# EAGLE schematic Prototype_1 (EAGLE 7.2.0)
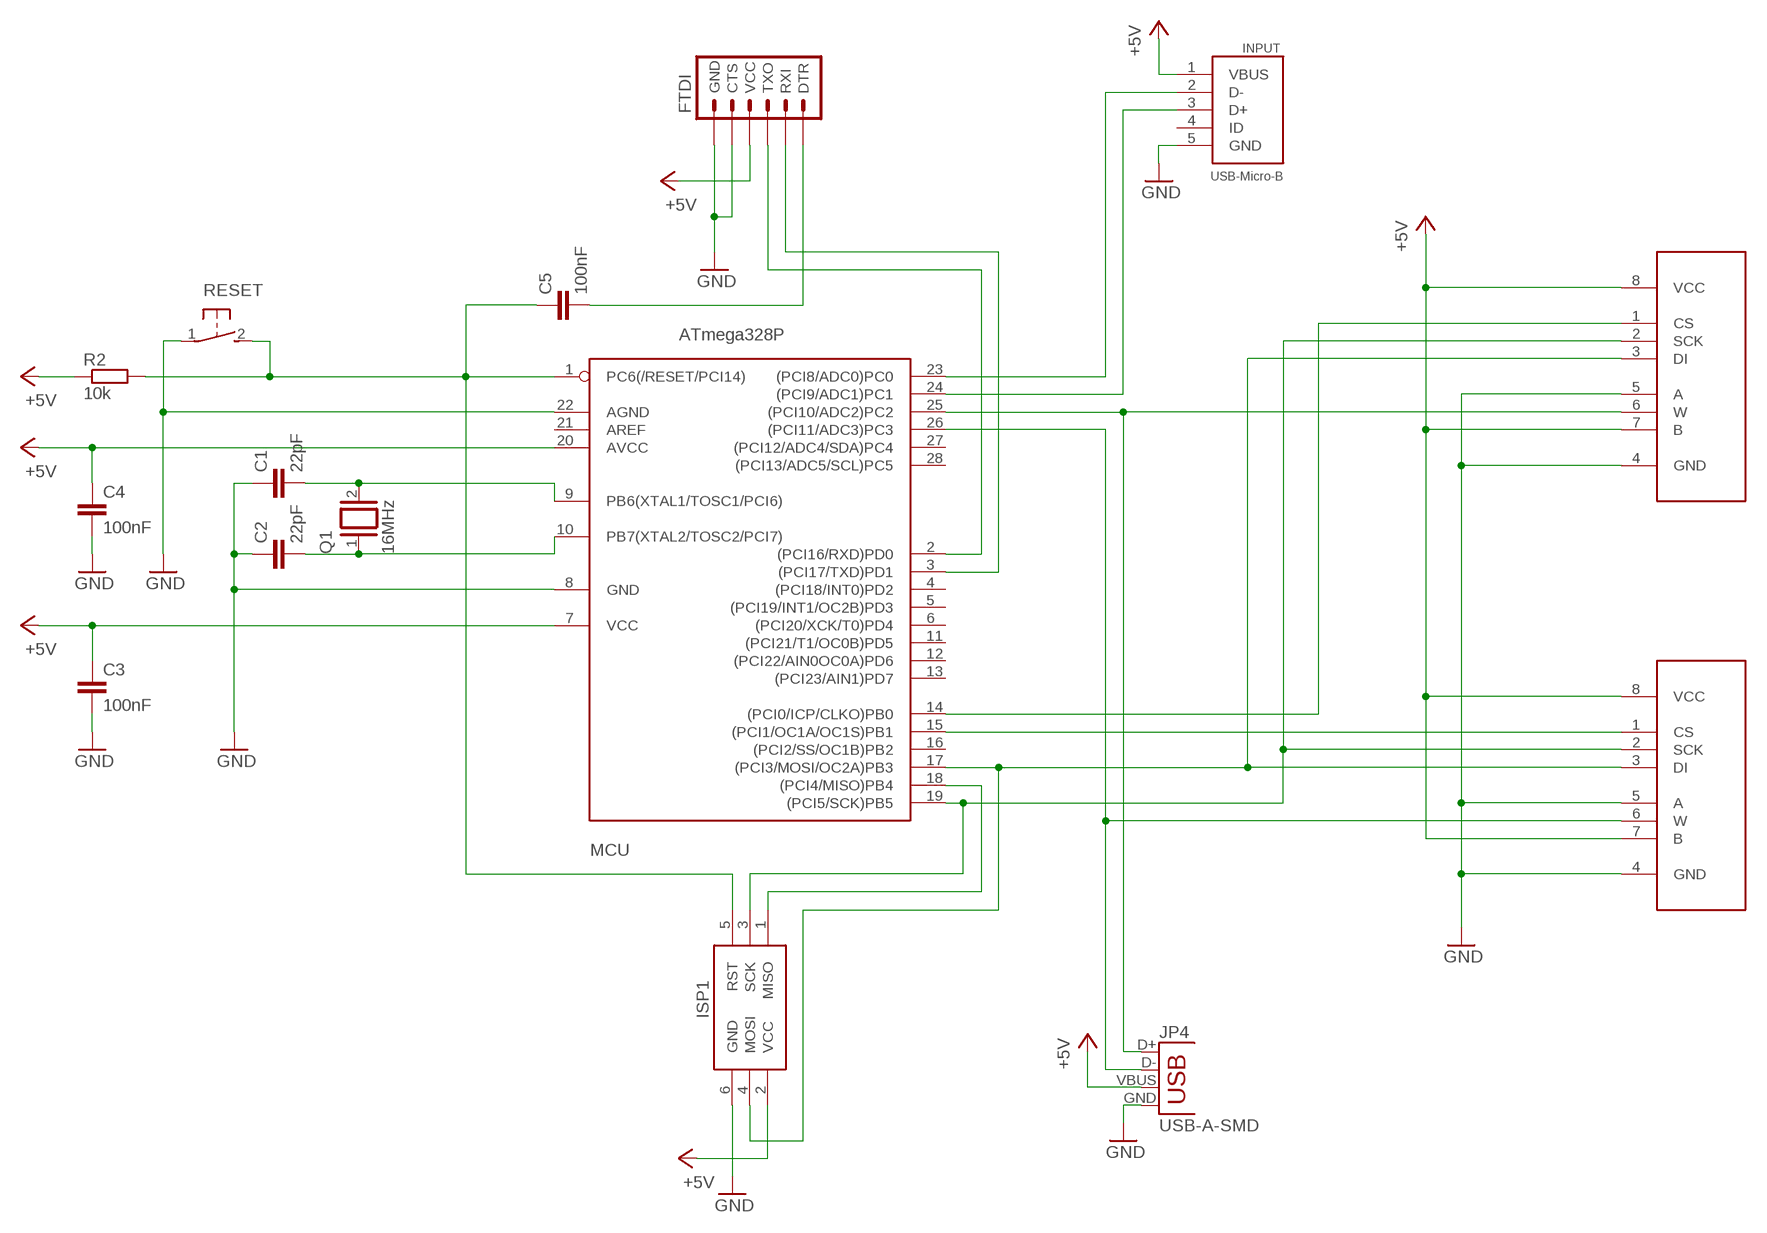
[diagram p0: schematic, sheet 1]

## Parts
C1  22pF  C-EU025-025X050  [C025-025X050]
C2  22pF  C-EU025-025X050  [C025-025X050]
C3  100nF  C-EU025-025X050  [C025-025X050]
C4  100nF  C-EU025-025X050  [C025-025X050]
C5  100nF  C-EU025-025X050  [C025-025X050]
FTDI  ARDUINO_SERIAL_PROGRAMPTH  [1X06]
INPUT  USB-Micro-B  USB-CON-5PIN-105017-0001  [USB-MICRO-MOLEX-105017-0001]
ISP1  AVRISP-6  [AVRISP]
JP4  USB-A-SMD  [USB-A-S-NOSILK-FEMALE]
MCU  ATmega328P  ATMEGA168-20P  [DIL28-3]
POTI  MCP41XXXDIL  [DIL-08]
POTI1  MCP41XXXDIL  [DIL-08]
Q1  16MHz  XTAL  [Q]
R2  10k  R-EU_0207/10  [0207/10]
RESET  31-XX  [B3F-31XX]

## Nets
+5V: C3.1 C4.1 FTDI.4(VCC) INPUT.1(VBUS) ISP1.2(VCC) JP4.VBUS MCU.7(VCC) MCU.20(AVCC) POTI1.7(B) POTI1.8(VCC) POTI.7(B) POTI.8(VCC) R2.1
GND: C1.1 C2.1 C3.2 C4.2 FTDI.5(CTS) FTDI.6(GND) INPUT.5(GND) ISP1.6(GND) JP4.GND MCU.8(GND) MCU.22(AGND) POTI1.4(GND) POTI1.5(A) POTI.4(GND) POTI.5(A) RESET.1(P)
MISO: ISP1.1(MISO) MCU.18((PCI4/MISO)PB4)
MOSI: ISP1.4(MOSI) MCU.17((PCI3/MOSI/OC2A)PB3) POTI1.3(DI) POTI.3(DI)
N$1: C1.2 MCU.9(PB6(XTAL1/TOSC1/PCI6)) Q1.2
N$2: C2.2 MCU.10(PB7(XTAL2/TOSC2/PCI7)) Q1.1
N$3: FTDI.3(TXO) MCU.2((PCI16/RXD)PD0)
N$4: C5.1 ISP1.5(RST) MCU.1(PC6(/RESET/PCI14)) R2.2 RESET.2(S)
N$5: FTDI.2(RXI) MCU.3((PCI17/TXD)PD1)
N$6: MCU.14((PCI0/ICP/CLKO)PB0) POTI1.1(CS)
N$7: MCU.15((PCI1/OC1A/OC1S)PB1) POTI.1(CS)
N$8: C5.2 FTDI.1(DTR)
N$10: JP4.D+ MCU.25((PCI10/ADC2)PC2) POTI1.6(W)
N$11: JP4.D- MCU.26((PCI11/ADC3)PC3) POTI.6(W)
N$14: INPUT.2(D-) MCU.23((PCI8/ADC0)PC0)
N$15: INPUT.3(D+) MCU.24((PCI9/ADC1)PC1)
SCK: ISP1.3(SCK) MCU.19((PCI5/SCK)PB5) POTI1.2(SCK) POTI.2(SCK)
Unconnected: INPUT.4(ID) MCU.4((PCI18/INT0)PD2) MCU.5((PCI19/INT1/OC2B)PD3) MCU.6((PCI20/XCK/T0)PD4) MCU.11((PCI21/T1/OC0B)PD5) MCU.12((PCI22/AIN0OC0A)PD6) MCU.13((PCI23/AIN1)PD7) MCU.16((PCI2/SS/OC1B)PB2) MCU.21(AREF) MCU.27((PCI12/ADC4/SDA)PC4) MCU.28((PCI13/ADC5/SCL)PC5)

## Library data of the parts
C1 C2 = resistor:C-EU: CAPACITOR, European symbol
C3-C5 = rcl:C-EU: CAPACITOR, European symbol
FTDI = SparkFun-Connectors:ARDUINO_SERIAL_PROGRAM: FTDI connector footprints
INPUT = GeekAmmo:USB-CON-5PIN: Molex Micro USB 105017-0001
ISP1 = adafruit:AVRISP: AVR ISP HEADER Standard 6 pin header for AVR programming
JP4 = SparkFun-Connectors:USB: USB Connectors USB-B-PTH is fully proven SKU : PRT-00139/CONN-08278 USB-miniB is fully proven SKU : PRT-00587 USB-A-PCB is untested. USB-A-H is throughly reviewed, but untested. Spark Fun Electronics SKU : PRT-00437 USB-B-SMT is throughly reviewed, but untested. Needs silkscreen touching up. USB-A-S has not been used/tested USB-MB-H has not been used/tested USB-MICROB has been used. CONN-09505; PROD_ID: CONN-09520
MCU = adafruit:ATMEGA168*P: MICROCONTROLLER 16 kBytes FLASH 1 kBytes SRAM 512 Bytes EEPROM USART 8-channel 10 bit ADC
POTI POTI1 = SparkFun-AnalogIC:MCP41XXX: SPI controlled single digital potentiometer by Microchip PID: COM-10613
Q1 = special:XTAL: CRYSTAL
R2 = resistor:R-EU_: RESISTOR, European symbol
RESET = switch-omron:31-XX: OMRON SWITCH; MPN: B3F-3100; OC_FARNELL: 959704; OC_NEWARK: 36M3582